# Altium schematic sheet MCU.SchDoc: MCU
size A3; Author: Tomás Valencia; DrawnBy: Tomás Valencia; DocumentNumber: 3; SheetNumber: 3; SheetTotal: 6
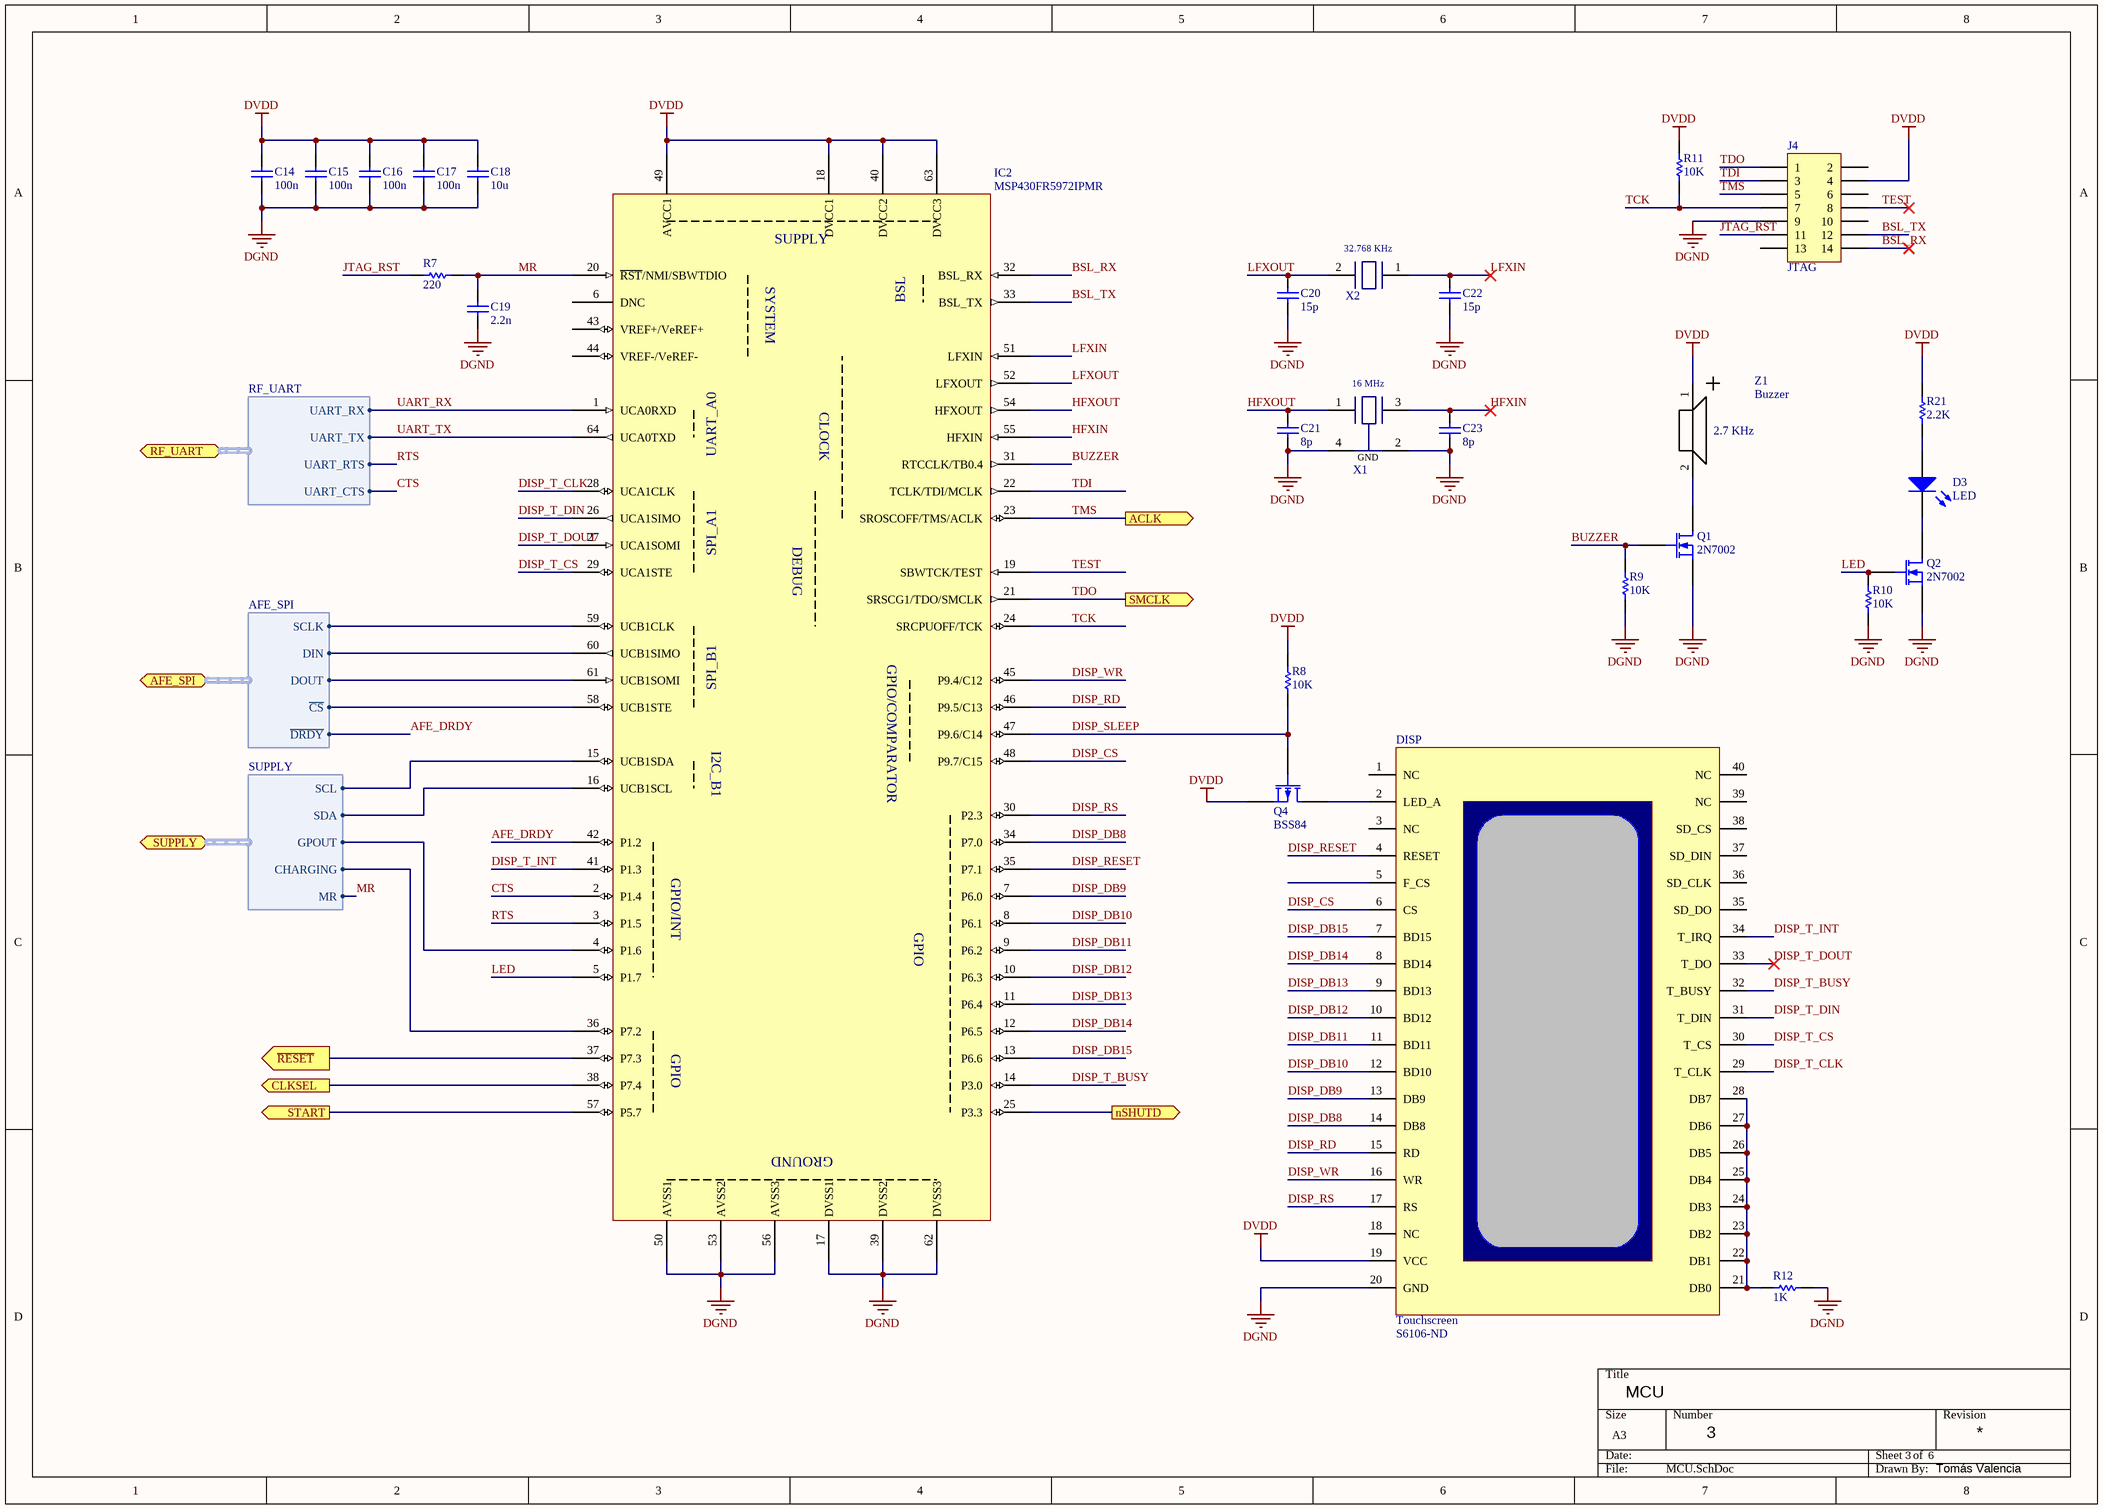
[diagram p0: MCU.SchDoc]

## Parts
C14  100n  [C0603]
C15  100n  [C0603]
C16  100n  [C0603]
C17  100n  [C0603]
C18  10u  [C0603]
C19  2.2n  [C0603]
C20  15p  [C0603]
C21  8p  [C0603]
C22  15p  [C0603]
C23  8p  [C0603]
D3  LED  [LED3015M]
DISP  Touchscreen  Supplier Part Number 1: S6106-ND  [TSCREEN_CONN]
IC2  MSP430FR5972IPMR  [MSP430FR5972]
J4  JTAG  [JTAG 14 PINS]
Q1  2N7002  [SOT65P210X110-3N]
Q2  2N7002  [SOT65P210X110-3N]
Q4  BSS84  [SOT65P210X110-3N]
R7  220  [R0603]
R8  10K  [R0603]
R9  10K  [R0603]
R10  10K  [R0603]
R11  10K  [R0603]
R12  1K  [R0603]
R21  2.2K  [R0603]
X1  XTAL_16MHZ  [XTAL_16_MHz]  (value not drawn)
X2  XTAL_32768  [xtal_32768]  (value not drawn)
Z1  Buzzer  [KSSG74B16]

## Ports
ACLK (out), AFE_SPI (harness AFE_SPI), CLKSEL (out), nSHUTD (out), RF_UART (harness RF_UART), SMCLK (out), START (out), SUPPLY (harness SUPPLY), ~{RESET} (out)

## Harnesses
AFE_SPI: SCLK, DIN, DOUT, ~{CS}, ~{DRDY}
RF_UART: UART_TX, UART_RX, UART_RTS, UART_CTS
SUPPLY: SDA, SCL, GPOUT, CHARGING, MR

## Nets
DGND: C14.1 C15.1 C16.1 C17.1 C18.1 C19.1 C20.2 C21.1 C22.2 C23.1 DISP.20(GND) IC2.17(DVSS1) IC2.39(DVSS2) IC2.50(AVSS1) IC2.53(AVSS2) IC2.56(AVSS3) IC2.62(DVSS3) J4.9 Q1.2(S) Q2.2(S) R9.1 R10.1 R12.2 X1.2(GND) X1.4(GND)
DVDD: C14.2 C15.2 C16.2 C17.2 C18.2 DISP.19(VCC) IC2.18(DVCC1) IC2.40(DVCC2) IC2.49(AVCC1) IC2.63(DVCC3) J4.4 Q4.2(S) R8.2 R11.2 R21.2 Z1.1(+)
AFE_DRDY: IC2.42(P1.2) ; port AFE_SPI.~{DRDY}
BSL_RX: IC2.32(BSL_RX) J4.14
BSL_TX: IC2.33(BSL_TX) J4.12
BUZZER: IC2.31(RTCCLK/TB0.4) Q1.1(G) R9.2
CLKSEL: IC2.38(P7.4) ; port CLKSEL
CTS: IC2.2(P1.4) ; port RF_UART.UART_CTS
DISP_CS: DISP.6(CS) IC2.48(P9.7/C15)
DISP_DB8: DISP.14(DB8) IC2.34(P7.0)
DISP_DB9: DISP.13(DB9) IC2.7(P6.0)
DISP_DB10: DISP.12(BD10) IC2.8(P6.1)
DISP_DB11: DISP.11(BD11) IC2.9(P6.2)
DISP_DB12: DISP.10(BD12) IC2.10(P6.3)
DISP_DB13: DISP.9(BD13) IC2.11(P6.4)
DISP_DB14: DISP.8(BD14) IC2.12(P6.5)
DISP_DB15: DISP.7(BD15) IC2.13(P6.6)
DISP_RD: DISP.15(RD) IC2.46(P9.5/C13)
DISP_RESET: DISP.4(RESET) IC2.35(P7.1)
DISP_RS: DISP.17(RS) IC2.30(P2.3)
DISP_SLEEP: IC2.47(P9.6/C14) Q4.1(G) R8.1
DISP_T_BUSY: DISP.32(T_BUSY) IC2.14(P3.0)
DISP_T_CLK: DISP.29(T_CLK) IC2.28(UCA1CLK)
DISP_T_CS: DISP.30(T_CS) IC2.29(UCA1STE)
DISP_T_DIN: DISP.31(T_DIN) IC2.26(UCA1SIMO)
DISP_T_DOUT: DISP.33(T_DO) IC2.27(UCA1SOMI)
DISP_T_INT: DISP.34(T_IRQ) IC2.41(P1.3)
DISP_WR: DISP.16(WR) IC2.45(P9.4/C12)
HFXIN: C23.2 IC2.55(HFXIN) X1.3(IN)
HFXOUT: C21.2 IC2.54(HFXOUT) X1.1(OUT)
JTAG_RST: J4.11 R7.1
LED: IC2.5(P1.7) Q2.1(G) R10.2
LFXIN: C22.1 IC2.51(LFXIN) X2.1(IN)
LFXOUT: C20.1 IC2.52(LFXOUT) X2.2(OUT)
MR: C19.2 IC2.20(~{RST}/NMI/SBWTDIO) R7.2 ; port SUPPLY.MR
nSHUTD: IC2.25(P3.3) ; port nSHUTD
~{RESET}: IC2.37(P7.3) ; port ~{RESET}
RTS: IC2.3(P1.5) ; port RF_UART.UART_RTS
START: IC2.57(P5.7) ; port START
TCK: IC2.24(SRCPUOFF/TCK) J4.7 R11.1
TDI: IC2.22(TCLK/TDI/MCLK) J4.3
TDO: IC2.21(SRSCG1/TDO/SMCLK) J4.1 ; port SMCLK
TEST: IC2.19(SBWTCK/TEST) J4.8
TMS: IC2.23(SROSCOFF/TMS/ACLK) J4.5 ; port ACLK
UART_RX: IC2.1(UCA0RXD) ; port RF_UART.UART_RX
UART_TX: IC2.64(UCA0TXD) ; port RF_UART.UART_TX
NetD3_1: D3.1(A) R21.1
NetD3_2: D3.2(K) Q2.3(D)
NetDISP_2: DISP.2(LED_A) Q4.3(D)
NetDISP_21: DISP.21(DB0) DISP.22(DB1) DISP.23(DB2) DISP.24(DB3) DISP.25(DB4) DISP.26(DB5) DISP.27(DB6) DISP.28(DB7) R12.1
NetIC2_4: IC2.4(P1.6) ; port SUPPLY.GPOUT
NetIC2_15: IC2.15(UCB1SDA) ; port SUPPLY.SCL
NetIC2_16: IC2.16(UCB1SCL) ; port SUPPLY.SDA
NetIC2_36: IC2.36(P7.2) ; port SUPPLY.CHARGING
NetIC2_58: IC2.58(UCB1STE) ; port AFE_SPI.~{CS}
NetIC2_59: IC2.59(UCB1CLK) ; port AFE_SPI.SCLK
NetIC2_60: IC2.60(UCB1SIMO) ; port AFE_SPI.DIN
NetIC2_61: IC2.61(UCB1SOMI) ; port AFE_SPI.DOUT
NetQ1_3: Q1.3(D) Z1.2(-)

Not connected (* = marked no-connect by the designer): DISP 1(NC) 3(NC) 5(F_CS) 18(NC) 35(SD_DO) 36(SD_CLK) 37(SD_DIN) 38(SD_CS) 39(NC) 40(NC); IC2 6(DNC) 43(VREF+/VeREF+) 44(VREF-/VeREF-); J4 2 6 10 13

## Notes on the sheet
- (in symbol Buzzer) 2.7 KHz
- (in symbol MSP430FR5972IPMR) SUPPLY; BSL; SYSTEM; UART_A0; CLOCK; SPI_A1; DEBUG; SPI_B1; GPIO/COMPARATOR; I2C_B1; GPIO/INT; GPIO; GROUND
- (in symbol XTAL_16_MHz) 16 MHz
- (in symbol XTAL_32768) 32.768 KHz

## Library data of the parts
C14-C23 = Capacitor: Rated Voltage: *
  C14-C17: Value: 100n
  C18: Value: 10u
  C19: Value: 2.2n
  C20 C22: Value: 15p
  C21 C23: Value: 8p
J4 = JTAG 14 Pins: JTAG 7X2 Pin Header 90º; Supplier 1: Digi-Key; Supplier Part Number 1: ED10534-ND
Q1 Q2 = 2N7002: Transistor, MOSFET, N-Channel, 60V, 300mA
Q4 = BSS84: Transistor, MOSFET, P-Channel, 60V, 300mA
R7-R12 R21 = Resistor: Power: *
  R7: Value: 220
  R8-R11: Value: 10K
  R12: Value: 1K
  R21: Value: 2.2K
X1 = XTAL_16_MHz
Z1 = Buzzer: Magnetic Buzzer 2.7 KHz; Supplier 1: Farnell; Supplier Part Number 1: 2215090
D3 = LED: Supplier 1: Farnell; Supplier 2: Farnell; Supplier 3: Farnell; Supplier 4: Farnell; Supplier Part Number 1: 2426228; Supplier Part Number 2: 2426227; Supplier Part Number 3: 2426230; Supplier Part Number 4: 2426229
DISP = Touchscreen: Supplier 1: Digi-Key
X2 = XTAL_32768: Supplier 1: Digi-Key; Supplier Part Number 1: 535-9032-ND